# Altium schematic sheet S7CAS-PLEIADES-CARTE-MERE_Pxx_ARBRE_CAP_ARBRE.SchDoc
size Tabloid; SheetNumber: 16; SheetTotal: 18; Sheet_Name: POWER TREE DECOUPLING; Size: 11x17
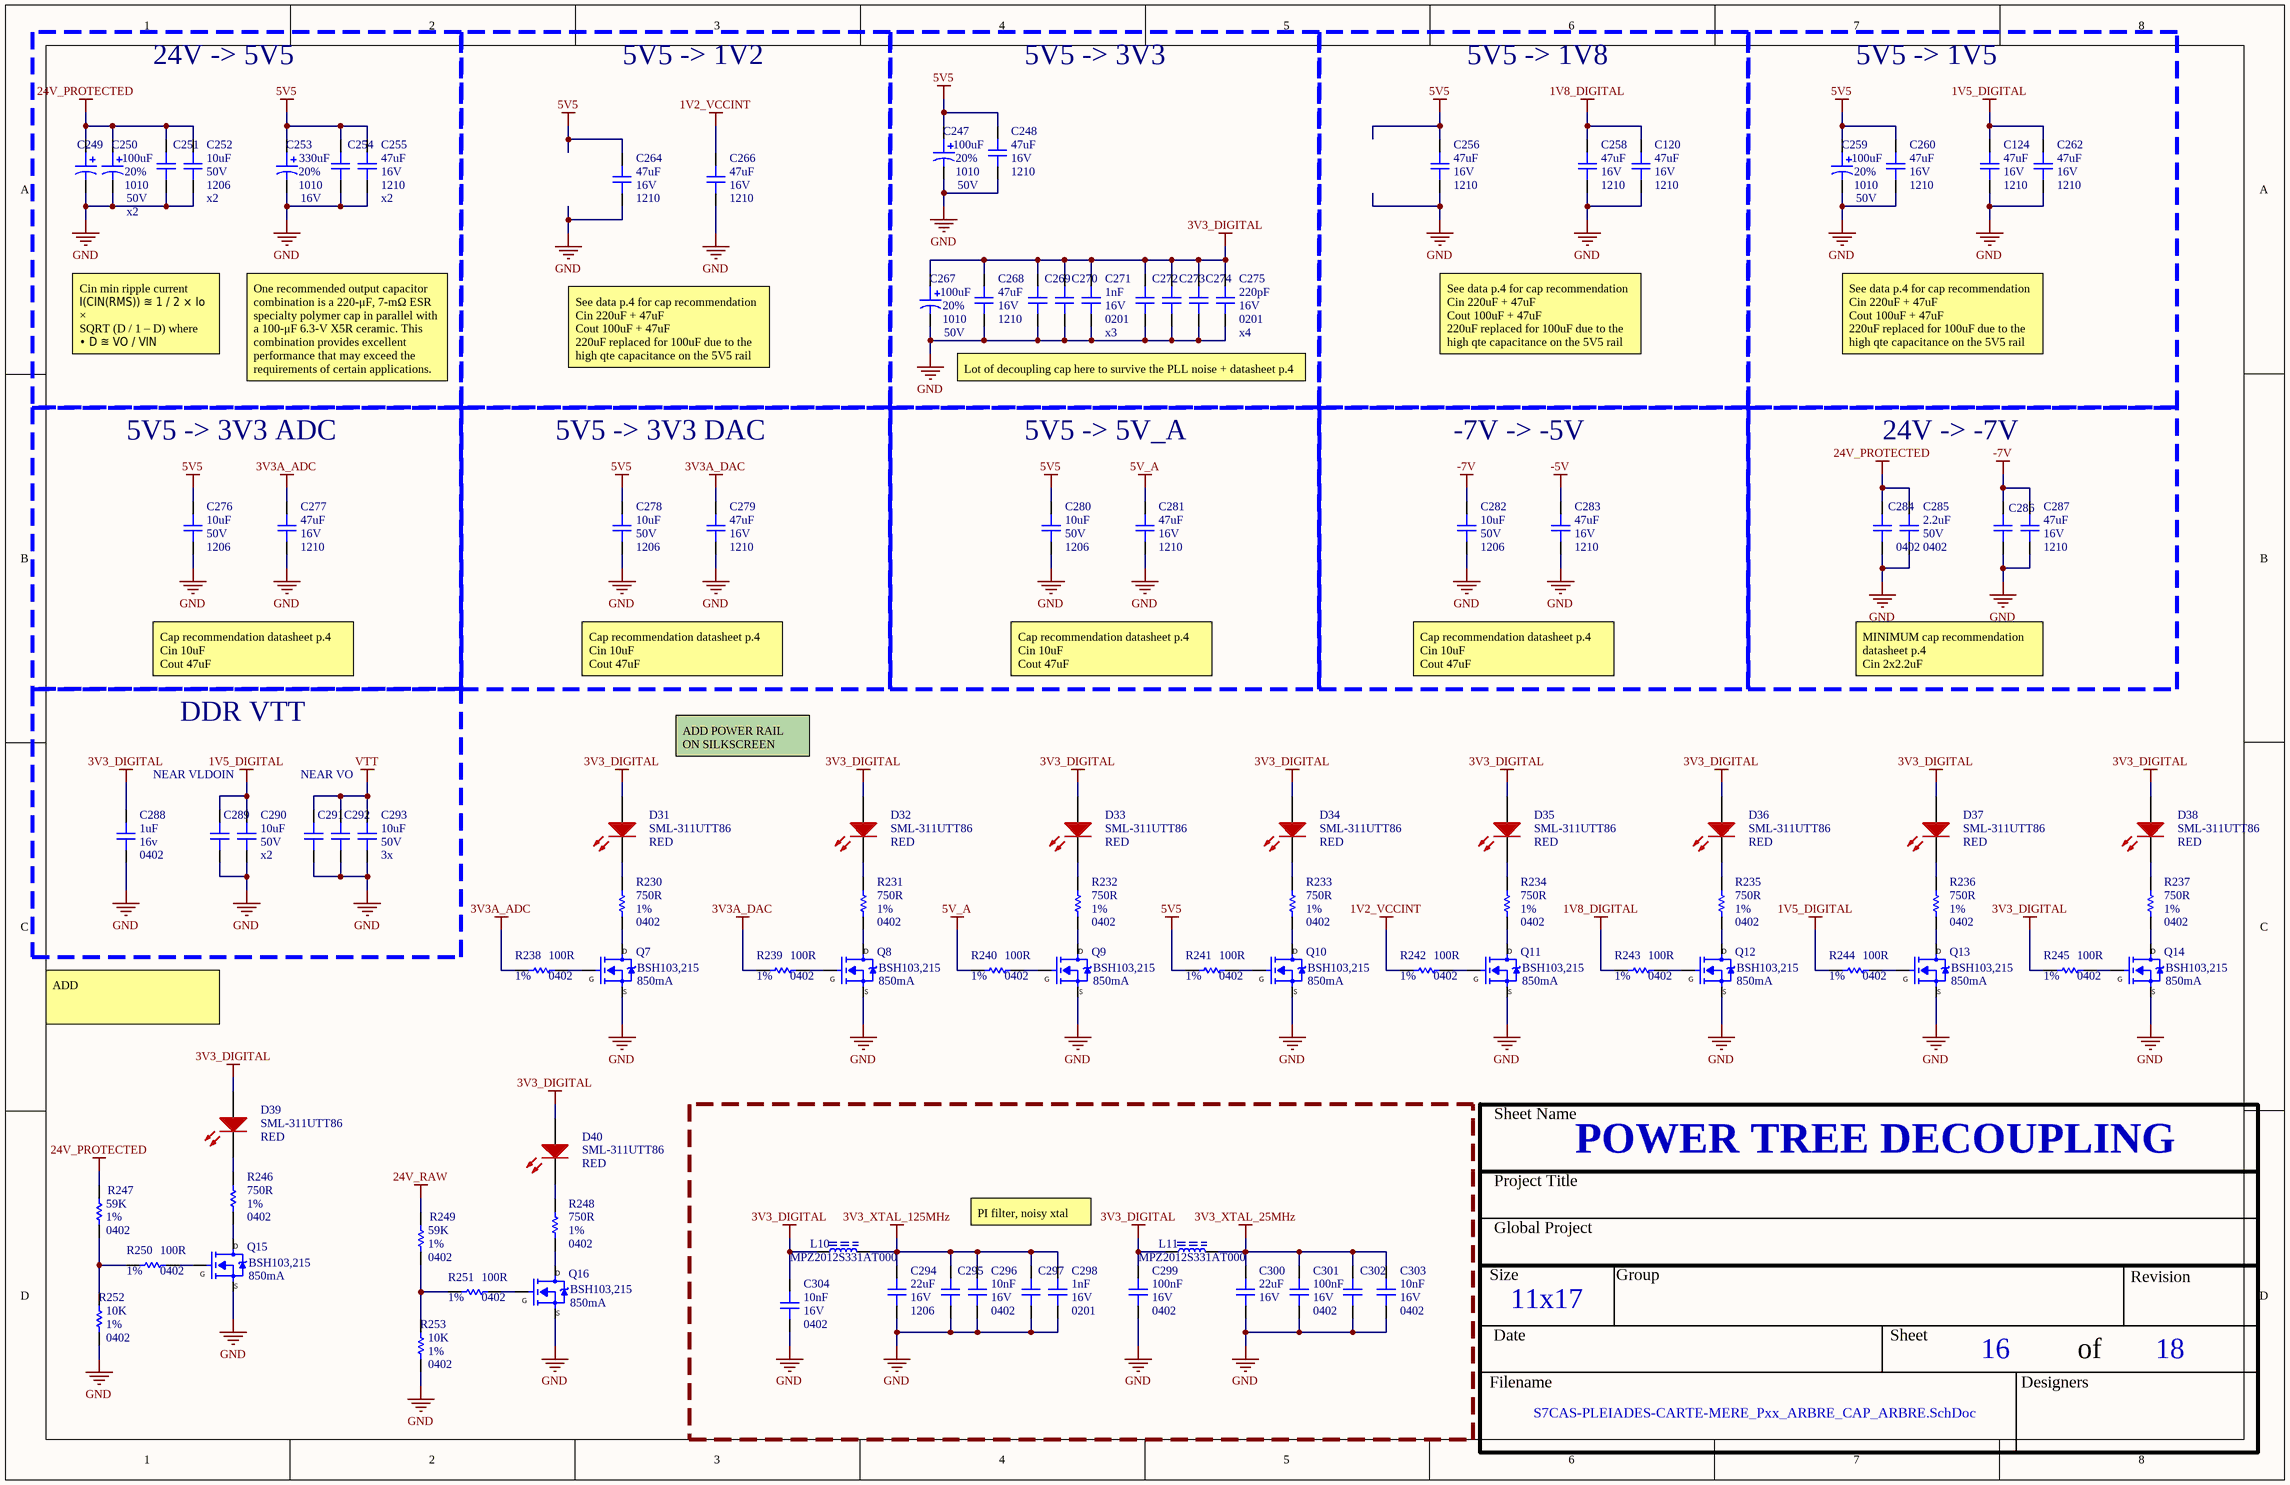
[diagram p0: S7CAS-PLEIADES-CARTE-MERE_Pxx_ARBRE_CAP_ARBRE.SchDoc]

## Parts
C120  value 47uF  Voltage: 16V  Package: 1210  [CAP_1210]  (hidden comment: CAP - 1210)
C124  value 47uF  Voltage: 16V  Package: 1210  [CAP_1210]  (hidden comment: CAP - 1210)
C247  value 100uF  Voltage: 50V  Package: 1010  Precision: 20%  [CAP_ALU_1010_vishay]  (hidden comment: MAL215099101E3)
C248  value 47uF  Voltage: 16V  Package: 1210  [CAP_1210]  (hidden comment: CAP - 1210)
C249  MAL215099101E3  [CAP_ALU_1010_vishay]  (value not drawn)
C250  value 100uF  Voltage: 50V  Package: 1010  Precision: 20%  [CAP_ALU_1010_vishay]  (hidden comment: MAL215099101E3)
C251  CAP - 1206  [CAP_1206]  (value not drawn)
C252  value 10uF  Voltage: 50V  Package: 1206  [CAP_1206]  (hidden comment: CAP - 1206)
C253  value 330uF  Voltage: 16V  Package: 1010  Precision: 20%  [CAP_ALU_1010_vishay]  (hidden comment: MAL214699501E3)
C254  CAP - 1210  [CAP_1210]  (value not drawn)
C255  value 47uF  Voltage: 16V  Package: 1210  [CAP_1210]  (hidden comment: CAP - 1210)
C256  value 47uF  Voltage: 16V  Package: 1210  [CAP_1210]  (hidden comment: CAP - 1210)
C258  value 47uF  Voltage: 16V  Package: 1210  [CAP_1210]  (hidden comment: CAP - 1210)
C259  value 100uF  Voltage: 50V  Package: 1010  Precision: 20%  [CAP_ALU_1010_vishay]  (hidden comment: MAL215099101E3)
C260  value 47uF  Voltage: 16V  Package: 1210  [CAP_1210]  (hidden comment: CAP - 1210)
C262  value 47uF  Voltage: 16V  Package: 1210  [CAP_1210]  (hidden comment: CAP - 1210)
C264  value 47uF  Voltage: 16V  Package: 1210  [CAP_1210]  (hidden comment: CAP - 1210)
C266  value 47uF  Voltage: 16V  Package: 1210  [CAP_1210]  (hidden comment: CAP - 1210)
C267  value 100uF  Voltage: 50V  Package: 1010  Precision: 20%  [CAP_ALU_1010_vishay]  (hidden comment: MAL215099101E3)
C268  value 47uF  Voltage: 16V  Package: 1210  [CAP_1210]  (hidden comment: CAP - 1210)
C269  CAP - 0201  [CAP_0201]  (value not drawn)
C270  CAP - 0201  [CAP_0201]  (value not drawn)
C271  value 1nF  Voltage: 16V  Package: 0201  [CAP_0201]  (hidden comment: CAP - 0201)
C272  CAP - 0201  [CAP_0201]  (value not drawn)
C273  CAP - 0201  [CAP_0201]  (value not drawn)
C274  CAP - 0201  [CAP_0201]  (value not drawn)
C275  value 220pF  Voltage: 16V  Package: 0201  [CAP_0201]  (hidden comment: CAP - 0201)
C276  value 10uF  Voltage: 50V  Package: 1206  [CAP_1206]  (hidden comment: CAP - 1206)
C277  value 47uF  Voltage: 16V  Package: 1210  [CAP_1210]  (hidden comment: CAP - 1210)
C278  value 10uF  Voltage: 50V  Package: 1206  [CAP_1206]  (hidden comment: CAP - 1206)
C279  value 47uF  Voltage: 16V  Package: 1210  [CAP_1210]  (hidden comment: CAP - 1210)
C280  value 10uF  Voltage: 50V  Package: 1206  [CAP_1206]  (hidden comment: CAP - 1206)
C281  value 47uF  Voltage: 16V  Package: 1210  [CAP_1210]  (hidden comment: CAP - 1210)
C282  value 10uF  Voltage: 50V  Package: 1206  [CAP_1206]  (hidden comment: CAP - 1206)
C283  value 47uF  Voltage: 16V  Package: 1210  [CAP_1210]  (hidden comment: CAP - 1210)
C284  Package: 0402  [CAP_0402]  (hidden comment: CAP - 0402)
C285  value 2.2uF  Voltage: 50V  Package: 0402  [CAP_0402]  (hidden comment: CAP - 0402)
C286  CAP - 1210  [CAP_1210]  (value not drawn)
C287  value 47uF  Voltage: 16V  Package: 1210  [CAP_1210]  (hidden comment: CAP - 1210)
C288  value 1uF  Voltage: 16v  Package: 0402  [CAP_0402]  (hidden comment: CAP - 0402)
C289  CAP - 0805  [CAP_0805]  (value not drawn)
C290  value 10uF  Voltage: 50V  [CAP_0805]  (hidden comment: CAP - 0805)
C291  CAP - 0805  [CAP_0805]  (value not drawn)
C292  CAP - 0805  [CAP_0805]  (value not drawn)
C293  value 10uF  Voltage: 50V  [CAP_0805]  (hidden comment: CAP - 0805)
C294  value 22uF  Voltage: 16V  Package: 1206  [CAP_1206]  (hidden comment: CAP - 1206)
C295  CAP - 0402  [CAP_0402]  (value not drawn)
C296  value 10nF  Voltage: 16V  Package: 0402  [CAP_0402]  (hidden comment: CAP - 0402)
C297  CAP - 0201  [CAP_0201]  (value not drawn)
C298  value 1nF  Voltage: 16V  Package: 0201  [CAP_0201]  (hidden comment: CAP - 0201)
C299  value 100nF  Voltage: 16V  Package: 0402  [CAP_0402]  (hidden comment: CAP - 0402)
C300  value 22uF  Voltage: 16V  [CAP_1206]  (hidden comment: CAP - 1206)
C301  value 100nF  Voltage: 16V  Package: 0402  [CAP_0402]  (hidden comment: CAP - 0402)
C302  CAP - 0402  [CAP_0402]  (value not drawn)
C303  value 10nF  Voltage: 16V  Package: 0402  [CAP_0402]  (hidden comment: CAP - 0402)
C304  value 10nF  Voltage: 16V  Package: 0402  [CAP_0402]  (hidden comment: CAP - 0402)
D31  SML-311UTT86  value RED  [LED_0603]
D32  SML-311UTT86  value RED  [LED_0603]
D33  SML-311UTT86  value RED  [LED_0603]
D34  SML-311UTT86  value RED  [LED_0603]
D35  SML-311UTT86  value RED  [LED_0603]
D36  SML-311UTT86  value RED  [LED_0603]
D37  SML-311UTT86  value RED  [LED_0603]
D38  SML-311UTT86  value RED  [LED_0603]
D39  SML-311UTT86  value RED  [LED_0603]
D40  SML-311UTT86  value RED  [LED_0603]
L10  Mfg Part Number: MPZ2012S331AT000  [FER_0805]  (hidden comment: FER - 0805)
L11  Mfg Part Number: MPZ2012S331AT000  [FER_0805]  (hidden comment: FER - 0805)
Q7  BSH103,215  Current: 850mA  [SOT23-3]
Q8  BSH103,215  Current: 850mA  [SOT23-3]
Q9  BSH103,215  Current: 850mA  [SOT23-3]
Q10  BSH103,215  Current: 850mA  [SOT23-3]
Q11  BSH103,215  Current: 850mA  [SOT23-3]
Q12  BSH103,215  Current: 850mA  [SOT23-3]
Q13  BSH103,215  Current: 850mA  [SOT23-3]
Q14  BSH103,215  Current: 850mA  [SOT23-3]
Q15  BSH103,215  Current: 850mA  [SOT23-3]
Q16  BSH103,215  Current: 850mA  [SOT23-3]
R230  value 750R  Package: 0402  Precision: 1%  [RES_0402]  (hidden comment: RES - 0402)
R231  value 750R  Package: 0402  Precision: 1%  [RES_0402]  (hidden comment: RES - 0402)
R232  value 750R  Package: 0402  Precision: 1%  [RES_0402]  (hidden comment: RES - 0402)
R233  value 750R  Package: 0402  Precision: 1%  [RES_0402]  (hidden comment: RES - 0402)
R234  value 750R  Package: 0402  Precision: 1%  [RES_0402]  (hidden comment: RES - 0402)
R235  value 750R  Package: 0402  Precision: 1%  [RES_0402]  (hidden comment: RES - 0402)
R236  value 750R  Package: 0402  Precision: 1%  [RES_0402]  (hidden comment: RES - 0402)
R237  value 750R  Package: 0402  Precision: 1%  [RES_0402]  (hidden comment: RES - 0402)
R238  value 100R  Package: 0402  Precision: 1%  [RES_0402]  (hidden comment: RES - 0402)
R239  value 100R  Package: 0402  Precision: 1%  [RES_0402]  (hidden comment: RES - 0402)
R240  value 100R  Package: 0402  Precision: 1%  [RES_0402]  (hidden comment: RES - 0402)
R241  value 100R  Package: 0402  Precision: 1%  [RES_0402]  (hidden comment: RES - 0402)
R242  value 100R  Package: 0402  Precision: 1%  [RES_0402]  (hidden comment: RES - 0402)
R243  value 100R  Package: 0402  Precision: 1%  [RES_0402]  (hidden comment: RES - 0402)
R244  value 100R  Package: 0402  Precision: 1%  [RES_0402]  (hidden comment: RES - 0402)
R245  value 100R  Package: 0402  Precision: 1%  [RES_0402]  (hidden comment: RES - 0402)
R246  value 750R  Package: 0402  Precision: 1%  [RES_0402]  (hidden comment: RES - 0402)
R247  value 59K  Package: 0402  Precision: 1%  [RES_0402]  (hidden comment: RES - 0402)
R248  value 750R  Package: 0402  Precision: 1%  [RES_0402]  (hidden comment: RES - 0402)
R249  value 59K  Package: 0402  Precision: 1%  [RES_0402]  (hidden comment: RES - 0402)
R250  value 100R  Package: 0402  Precision: 1%  [RES_0402]  (hidden comment: RES - 0402)
R251  value 100R  Package: 0402  Precision: 1%  [RES_0402]  (hidden comment: RES - 0402)
R252  value 10K  Package: 0402  Precision: 1%  [RES_0402]  (hidden comment: RES - 0402)
R253  value 10K  Package: 0402  Precision: 1%  [RES_0402]  (hidden comment: RES - 0402)

## Blocks framed on the sheet
24V -> 5V5: C249-C255
5V5 -> 1V2: C264 C266
5V5 -> 3V3: C247 C248 C267-C275
5V5 -> 1V8: C120 C256 C258
5V5 -> 1V5: C124 C259 C260 C262
5V5 -> 3V3 ADC: C276 C277
5V5 -> 3V3 DAC: C278 C279
5V5 -> 5V_A: C280 C281
-7V -> -5V: C282 C283
24V -> -7V: C284-C287
DDR VTT: C288-C293

## Nets
1V2_VCCINT: C266.2 R242.2
1V5_DIGITAL: C124.2 C262.2 C289.2 C290.2 R244.2
1V8_DIGITAL: C120.2 C258.2 R243.2
3V3_DIGITAL: C267.1 C268.2 C269.2 C270.2 C271.2 C272.2 C273.2 C274.2 C275.2 C288.2 C299.2 C304.2 D31.A D32.A D33.A D34.A D35.A D36.A D37.A D38.A D39.A D40.A L10.2 L11.2 R245.2
3V3_XTAL_25MHz: C300.2 C301.2 C302.2 C303.2 L11.1
3V3_XTAL_125MHz: C294.2 C295.2 C296.2 C297.2 C298.2 L10.1
3V3A_ADC: C277.2 R238.2
3V3A_DAC: C279.2 R239.2
5V5: C247.1 C248.2 C253.1 C254.2 C255.2 C256.2 C259.1 C260.2 C264.2 C276.2 C278.2 C280.2 R241.2
5V_A: C281.2 R240.2
24V_PROTECTED: C249.1 C250.1 C251.2 C252.2 C284.2 C285.2 R247.2
24V_RAW: R249.2
-5V: C283.2
-7V: C282.2 C286.2 C287.2
GND: C120.1 C124.1 C247.2 C248.1 C249.2 C250.2 C251.1 C252.1 C253.2 C254.1 C255.1 C256.1 C258.1 C259.2 C260.1 C262.1 C264.1 C266.1 C267.2 C268.1 C269.1 C270.1 C271.1 C272.1 C273.1 C274.1 C275.1 C276.1 C277.1 C278.1 C279.1 C280.1 C281.1 C282.1 C283.1 C284.1 C285.1 C286.1 C287.1 C288.1 C289.1 C290.1 C291.1 C292.1 C293.1 C294.1 C295.1 C296.1 C297.1 C298.1 C299.1 C300.1 C301.1 C302.1 C303.1 C304.1 Q7.2 Q8.2 Q9.2 Q10.2 Q11.2 Q12.2 Q13.2 Q14.2 Q15.2 Q16.2 R252.1 R253.1
VTT: C291.2 C292.2 C293.2
NetD31_K: D31.K R230.2
NetD32_K: D32.K R231.2
NetD33_K: D33.K R232.2
NetD34_K: D34.K R233.2
NetD35_K: D35.K R234.2
NetD36_K: D36.K R235.2
NetD37_K: D37.K R236.2
NetD38_K: D38.K R237.2
NetD39_K: D39.K R246.2
NetD40_K: D40.K R248.2
NetQ7_1: Q7.1 R238.1
NetQ7_3: Q7.3 R230.1
NetQ8_1: Q8.1 R239.1
NetQ8_3: Q8.3 R231.1
NetQ9_1: Q9.1 R240.1
NetQ9_3: Q9.3 R232.1
NetQ10_1: Q10.1 R241.1
NetQ10_3: Q10.3 R233.1
NetQ11_1: Q11.1 R242.1
NetQ11_3: Q11.3 R234.1
NetQ12_1: Q12.1 R243.1
NetQ12_3: Q12.3 R235.1
NetQ13_1: Q13.1 R244.1
NetQ13_3: Q13.3 R236.1
NetQ14_1: Q14.1 R245.1
NetQ14_3: Q14.3 R237.1
NetQ15_1: Q15.1 R250.1
NetQ15_3: Q15.3 R246.1
NetQ16_1: Q16.1 R251.1
NetQ16_3: Q16.3 R248.1
NetR247_1: R247.1 R250.2 R252.2
NetR249_1: R249.1 R251.2 R253.2

## Notes on the sheet
- x2
- (near C252) x2
- (near C255) x2
- Cin min ripple current
  I(CIN(RMS)) ≊ 1 / 2 × Io ×
  SQRT (D / 1 – D) where
  • D ≊ VO / VIN
  Iripple = 0.55A
- See data p.4 for cap recommendation
  Cin 220uF + 47uF
  Cout 100uF + 47uF
  220uF replaced for 100uF due to the high qte capacitance on the 5V5 rail
- x3
- (near C275) x4
- One recommended output capacitor combination is a 220-μF, 7-mΩ ESR specialty polymer cap in parallel with a 100-μF 6.3-V X5R ceramic. This combination provides excellent performance that may exceed the requirements of certain applications.
- Lot of decoupling cap here to survive the PLL noise + datasheet p.4
- Cap recommendation datasheet p.4
  Cin 10uF
  Cout 47uF
- MINIMUM cap recommendation datasheet p.4
  Cin 2x2.2uF
  Cout 2x47uF
- ADD POWER RAIL
  ON SILKSCREEN
- NEAR VLDOIN
- NEAR VO
- (near C290) x2
- (near C293) 3x
- ADD
- PI filter, noisy xtal
- Sheet Name
- Project Title
- Global Project
- Size
- Group
- Revision
- Date
- Sheet
- of
- Filename
- Designers
- (in symbol MOS_N_CHANNEL) D; G; S

## Library data of the parts
C120 C124 C248 C255 C256 C258 C260 C262 C264 C266 C268 C277 C279 C281 C283 C287 = CAP - 1210: Precision: 10%; Current: *; CreatedBy: Jonathan Bouchard; Power: *; Supplier 1: Arrow Electronics; Supplier Part Number 1: CL32A476KOJNNNE
C247 C249 C250 C259 C267 = CAP_ALU_MAL215099101E3: CAP - ALU 100uF 20% 50V - 1010; Current: 490mA; Mfg: Vishay Dale; Mfg Part Number: MAL215099101E3; HelpURL: http://www.vishay.com/docs/28395/150crz.pdf; CreatedBy: Jonathan Bouchard; Temperature: -55°C to 125°C; Power: *; Supplier 1: Digikey; Supplier Part Number 1: 4399PHDKR-ND
C251 = CAP - 1206: Precision: 10%; Voltage: 50V; Value: 10uF; Current: *; CreatedBy: Jonathan Bouchard; Power: *; Package: 1206; Supplier 1: Avnet; Supplier Part Number 1: CL31A106MBHNNNE
C252 C276 C278 C280 C282 C294 C300 = CAP - 1206: Precision: 10%; Current: *; CreatedBy: Jonathan Bouchard; Power: *
  C252 C276 C278 C280 C282: Supplier 1: Avnet; Supplier Part Number 1: CL31A106MBHNNNE
  C294: Supplier 1: Arrow Electronics; Supplier Part Number 1: CL31A226MOCLNNC
  C300: Package: 1206; Supplier 1: Arrow Electronics; Supplier Part Number 1: CL31A226MOCLNNC
C253 = CAP_ALU_MAL214699501E3: CAP - ALU 330uF 20% 16V - 1010; Current: 750mA; Mfg: Vishay Dale; Mfg Part Number: MAL214699501E3; HelpURL: http://www.vishay.com/docs/28403/146cti.pdf; CreatedBy: Jonathan Bouchard; Temperature: -55°C to 125°C; Power: *; Supplier 1: Digikey; Supplier Part Number 1: 4405PHCT-ND
C254 C286 = CAP - 1210: Precision: 10%; Voltage: 16V; Value: 47uF; Current: *; CreatedBy: Jonathan Bouchard; Power: *; Package: 1210; Supplier 1: Arrow Electronics; Supplier Part Number 1: CL32A476KOJNNNE
C269 C270 C297 = CAP - 0201: Precision: 10%; Voltage: 16V; Value: 1nF; Current: *; CreatedBy: Jonathan Bouchard; Power: *; Package: 0201; Supplier 1: Avnet; Supplier Part Number 1: GRM033R71C102KA01J
C271 C275 C298 = CAP - 0201: Precision: 10%; Current: *; CreatedBy: Jonathan Bouchard; Power: *
  C271 C298: Supplier 1: Avnet; Supplier Part Number 1: GRM033R71C102KA01J
  C275: Supplier 1: Arrow Electronics; Supplier Part Number 1: GRM033R71C221KA01D
C272-C274 = CAP - 0201: Precision: 10%; Voltage: 16V; Value: 220pF; Current: *; CreatedBy: Jonathan Bouchard; Power: *; Package: 0201; Supplier 1: Arrow Electronics; Supplier Part Number 1: GRM033R71C221KA01D
C284 = CAP - 0603: Precision: 10%; Voltage: 50V; Value: 2.2uF; Current: *; CreatedBy: Jonathan Bouchard; Power: *; Supplier 1: Arrow Electronics; Supplier Part Number 1: GRM188R61H225KE11D
C285 C288 C299 C301 = CAP - 0603: Precision: 10%; Current: *; CreatedBy: Jonathan Bouchard; Power: *; Supplier 1: Arrow Electronics
  C285: Supplier Part Number 1: GRM188R61H225KE11D
  C288: Supplier Part Number 1: CL10B105MO8NNWC
  C299 C301: Supplier Part Number 1: CL10B104KO8NNNC
C289 C291 C292 = CAP - 0805: Precision: 10%; Voltage: 50V; Value: 10uF; Current: *; CreatedBy: Jonathan Bouchard; Power: *; Package: 0805; Supplier 1: Avnet; Supplier Part Number 1: CL31A106MBHNNNE
C290 C293 = CAP - 0805: Precision: 10%; Current: *; CreatedBy: Jonathan Bouchard; Power: *; Package: 0805; Supplier 1: Avnet; Supplier Part Number 1: CL31A106MBHNNNE
C295 C302 = CAP - 0402: Precision: 10%; Voltage: 16V; Value: 10nF; Current: *; CreatedBy: Jonathan Bouchard; Power: *; Package: 0402; Supplier 1: Arrow Electronics; Supplier Part Number 1: GRM155R61A224KE19D
C296 C303 C304 = CAP - 0402: Precision: 10%; Current: *; CreatedBy: Jonathan Bouchard; Power: *; Supplier 1: Arrow Electronics; Supplier Part Number 1: GRM155R61A224KE19D
D31-D40 = LED_SML-311UTT86: LED - 620nM RED 2mA - 0603; Voltage: 1.8V; Mfg: ROHM Semiconductor; Power: 44mW; Current: 2mA; HelpURL: http://media.digikey.com/pdf/Data%20Sheets/Rohm%20PDFs/SML-311%20Series.pdf; CreatedBy: Jonathan Bouchard; Temperature: -30°C to 85°C; Package: 0603; Precision: *; Mfg Part Number: SML-311UTT86; Supplier 1: Digikey; Supplier Part Number 1: 511-1304-1-ND
L10 L11 = FER - 0805: Mfg: TDK Corporation; Current: 2.5A; Value: 50mR@0Hz / 330R@100MHz; Voltage: *; CreatedBy: Jonathan Bouchard; Power: *; Precision: *; Package: 0805; Supplier 1: Arrow Electronics; Supplier Part Number 1: MPZ2012S331AT000
Q7-Q16 = MOS_N_CHANNEL: N-Channel  Enhancement Mode Field Effect Transistor; Mfr: *; Package / Case: *; Vds: *; Rds ON: *; Vgs: *; Operating Temperature: *; Supplier 1: Avnet; Supplier Part Number 1: BSH103,215
R230-R253 = RES - 0603: Current: *; CreatedBy: Jonathan Bouchard; Supplier 1: Arrow Electronics
  R230-R237 R246 R248: Supplier Part Number 1: RMCF0603FT750R
  R238-R245 R250 R251: Supplier Part Number 1: RMCF0603FT100R
  R247 R249: Supplier Part Number 1: RMCF0603FT59K0
  R252 R253: Supplier Part Number 1: RMCF0603FT10K0